# Altium schematic sheet 4_Darlington Pair Amplifier.SchDoc
size A4; SheetNumber: 5; SheetTotal: 6
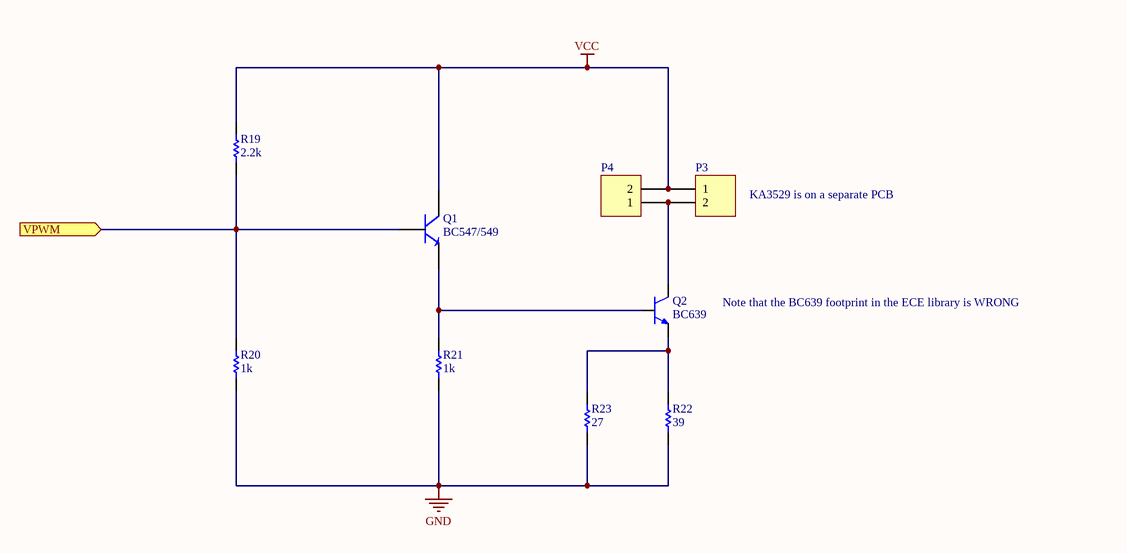
[diagram p0: 4_Darlington Pair Amplifier.SchDoc]

## Parts
P3  Header 2  [ece-HDR1X2]  (value not drawn)
P4  Header 2  [ece-HDR1X2]  (value not drawn)
Q1  BC547/549  [ece-TO-92Z]
Q2  BC639  [TO92]
R19  2.2k  [ece-AXIAL0.4]
R20  1k  [ece-AXIAL0.4]
R21  1k  [ece-AXIAL0.4]
R22  39  [ece-AXIAL0.4]
R23  27  [ece-AXIAL0.4]

## Ports
VPWM (in)

## Nets
GND: R20.2 R21.2 R22.2 R23.2
VCC: P3.1 P4.2 Q1.1(C) R19.1
VPWM: Q1.2(B) R19.2 R20.1 ; port VPWM
NetP3_2: P3.2 P4.1 Q2.2
NetQ1_3: Q1.3(E) Q2.3 R21.1
NetQ2_1: Q2.1 R22.1 R23.1

## Notes on the sheet
- KA3529 is on a separate PCB
- Note that the BC639 footprint in the ECE library is WRONG

## Library data of the parts
P3 P4 = Header 2: Header, 2-Pin; LatestRevisionDate: 17-Jul-2002; LatestRevisionNote: Re-released for DXP Platform.; Publisher: Altium Limited
Q1 = BC547/549: NPN Transistor; Value: BC547/549
Q2 = BC639: BC639 with correct footprint
R19-R23 = Res1: Resistor; Published: 8-Jun-2000; LatestRevisionDate: 17-Jul-2002; LatestRevisionNote: Re-released for DXP Platform.; PackageReference: AXIAL-0.3; Publisher: Altium Limited
  R19: Value: 2.2k
  R20 R21: Value: 1k
  R22: Value: 39
  R23: Value: 27